# Altium schematic sheet Main.SchDoc: ...
size A4; Author: Eng. Juan Cruz Becerra; CompanyName: www.indiic.com; DrawnBy: Juan Cruz Becerra; Engineer: Juan Cruz Becerra; Organization: INDIIC ®; Address1: Haya de la Torre 183; Address2: X5000; Address3: Córdoba, Argentina; Address4: .; DocumentNumber: 00-00; Revision: XX; SheetNumber: 1; SheetTotal: 1
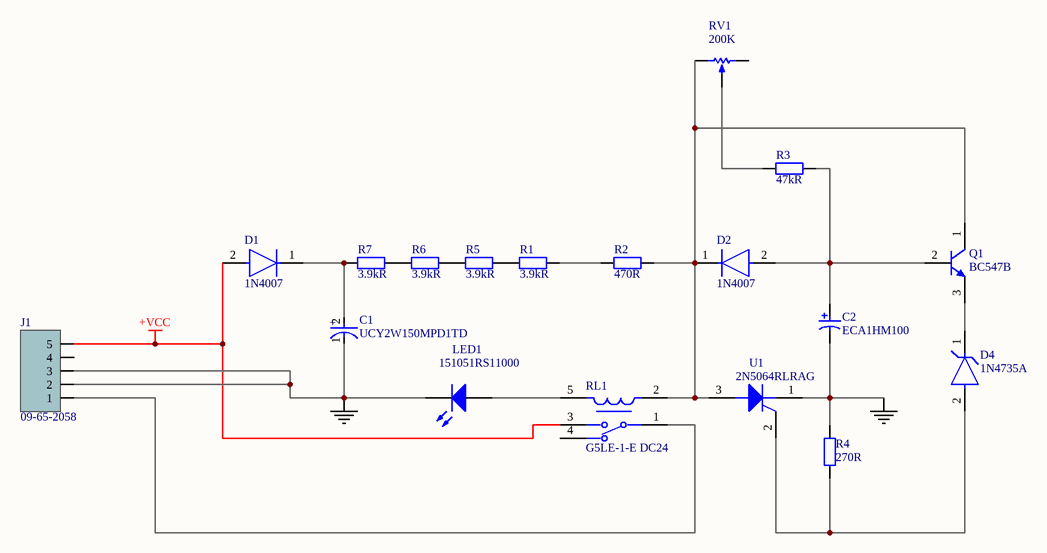
[diagram p0: Main.SchDoc]

## Parts
C1  UCY2W150MPD1TD  [FP-UCY2W150MPD1TD-MFG]
C2  ECA1HM100  [CAPPR55-200-1100X500X1200]
D1  1N4007  [FP-1N4007-MFG]
D2  1N4007  [FP-1N4007-MFG]
D4  1N4735A  [FP-017AH-MFG]
J1  Manufacturer Part Number: 09-65-2058  [09652058]  (hidden comment: 09652058)
LED1  151051RS11000  [Type 5mm]
Q1  BC547B  [ONSC-TO-92-3-29-11]
R1  Resistance: 3.9kR  [AXIAL-0.7]  (hidden comment: PR02000203901JA100)
R2  value 470R  [AXIAL-0.4]  (hidden comment: SFR16S0004700JA500)
R3  value 47kR  [AXIAL-0.4]  (hidden comment: RNF14FTD47K0)
R4  Resistance: 270R  [AXIAL-0.4]  (hidden comment: SFR16S0002700JA500)
R5  Resistance: 3.9kR  [AXIAL-0.7]  (hidden comment: PR02000203901JA100)
R6  Resistance: 3.9kR  [AXIAL-0.7]  (hidden comment: PR02000203901JA100)
R7  Resistance: 3.9kR  [AXIAL-0.7]  (hidden comment: PR02000203901JA100)
RL1  G5LE-1-E DC24  [FP-G5LE-1-E_DC24-MFG]
RV1  200K  [HDR1X2]
U1  2N5064RLRAG  [ONSC-TO-92-3-29-11]

## Nets
+VCC: D1.2(A) J1.5 RL1.3
GND: C1.1(C) C2.2 J1.2 J1.3 LED1.1(K) R4.2 U1.1(K)
NetC1_2: C1.2(A) D1.1(C) R7.2
NetC2_1: C2.1 D2.2(A) Q1.2(B) R3.2
NetD2_1: D2.1(C) Q1.1(C) R2.2 RL1.2 RV1.1(TOP) U1.3(A)
NetD4_1: D4.1(C) Q1.3(E)
NetD4_2: D4.2(A) R4.1 U1.2(G)
NetJ1_1: J1.1 RL1.1
NetLED1_2: LED1.2(A) RL1.5
NetR1_1: R1.1 R5.1
NetR1_2: R1.2 R2.1
NetR3_1: R3.1 RV1.3(TAP)
NetR5_2: R5.2 R6.2
NetR6_1: R6.1 R7.1

Not connected (* = marked no-connect by the designer): J1 4; RL1 4; RV1 2(BOT)

## Notes on the sheet
- Title
- Size:
- Date:
- Drawn By:
- A4
- Number:
- Time:
- Revision:
- Sheet
- Engineer:
- of
- File:
- (in symbol CMP-12462-000049-1) +

## Library data of the parts
C1 = CMP-12462-000049-1: CAP ALUM 15UF 20% 450V RADIAL; Life (Hours): 12000Hour; Ripple Current: 185mA; Capacitance: 15uF; Lead Pitch: 0.197inch; Height - Seated (Max): 1.043inch; Mount: Through Hole; Packaging: Tape and Reel; Voltage Rating: 450V; Min Operating Temperature: -25°C; Max Operating Temperature: 105°C; Tolerance: 20%; Package Quantity: 500; Case/Package: Radial
C2 = CMP-1665-00038-2: Aluminum Electrolytic Capacitor, 10 uF, +/- 20%, 50 V, -40 to 85 degC, 2-Pin THD, RoHS, Bulk; Manufacturer: Panasonic; Life (Hours): 2000Hour; Lead/Base Style: Straight; Dissipation Factor: 0.12%; Capacitance: 10uF; Leakage Current: 3uA; Dielectric Material: Aluminium; Lead Diameter: 0.5mm; Voltage Rating: 50V; Ripple Current: 65mA; Package Reference: CAPPR55-200-1100X500X1200; Height: 11mm; Diameter: 5mm; REACH SVHC: NoSVHC; Mount: ThroughHole; Packaging: Bulk; Manufacturer URL: http://www.panasonic.com/; Termination: Radial; Datasheet URL: https://industrial.panasonic.com/cdbs/www-data/pdf/RDF0000/ABA0000C1218.pdf; Lead Free: LeadFree; Height - Seated (Max): 0.472inch; Case/Package: Radial; Package Description: 2-Pin Radial Lead, Dia 5 mm, Height 12 mm; Tolerance: 20%; Datasheet Version: Rev. 05, 10/2016; Package Quantity: 200; Ripple Current (AC): 65mA; Min Operating Temperature: -40degC; RoHSCompliant: true; Number of Pins: 2; Max Operating Temperature: 85degC; Voltage: 50V; Lead Pitch: 2mm; Radiation Hardening: No; Voltage Rating (DC): 50V; Length: 11mm
D1 D2 = CMP-123542-000001-1: Rectifier diode 1000 V 1 A DO-41, ,; Manufacturer: Diotec; Max Surge Forward Current: 27A; Forward Current: 1A; Max Junction Temp: +175°C; Reverse Voltage: 1000V; Value: 15pF; Peak Reverse Current: 5uA; Category: Diode; Temperature Range Low: -50°C; Automotive: No; Temperature: -50°C to +175°C; Lead Free: Yes; ComponentLink2Description: Datasheet; Max Repetitive Reverse Voltage: 1000V; ComponentLink2URL: https://datasheet.octopart.com/1N4007-Diotec-datasheet-62346875.pdf; Manufacturer Part Number: 1N4007; Device Class L3: Rectifier Diodes; Height: 2.8mm; Octopart: https://octopart.com/1n4007-diotec-4040411; Package: 1N4007; Temperature Range High: +175°C; Device Class L1: Discrete Semiconductors; Device Class L2: Diodes; RoHS: TRUE; Capacitance: 15pF; Ipc Land Pattern Name: DIOAD888W100L520D280
D4 = CMP-0892-00008-2: DIODE ZENER 6.2V 1W DO41; Manufacturer: ON Semiconductor; Max Junction Temp: +200°C; Reverse Voltage: 3V; Max Zener Voltage: 6.51V; Zener Impedance: 2Ω; Max Reverse Leakage Current: 10uA; Device Class L2: Diodes; Ipc Land Pattern Name: DIOPA1088W105L520D272; Temperature Range High: +200°C; Device Class L3: Zener Diodes; Digikey Description: DIODE ZENER 6.2V 1W DO41; Lead Free: Yes; Octopart: https://octopart.com/1n4735a-on+semiconductor-3533934; Power Dissipation: 1W; ComponentLink2Description: Datasheet; RoHS: TRUE; ComponentLink2URL: https://www.onsemi.cn/PowerSolutions/document/1N4736AT-D.PDF; Automotive: No; Package: 017AH; Footprint Url: https://www.onsemi.com/pub/Collateral/017AH.PDF; Manufacturer Part Number: 1N4735A; Height: 2.72mm; Temperature Range Low: -65°C; Mouser Description: Zener Diodes 6.2V 1W ZENER 5%; Device Class L1: Discrete Semiconductors; Nom Zener Voltage: 6.2V; Category: Diode; Temperature: -65°C to +200°C
J1 = 09652058: SPOX™ and KK® 396 Wire-to-Board Header, Vertical, with Friction Lock, 5 Circuits; Manufacturer: Molex; Number of Positions: 5; Current Rating: 7A; Voltage Rating: 250V; Contact Resistance: 10mR; Gender: Male; Pitch: 3.96mm; RoHS: Yes; Category: Headers and Wire Housings; Mount: Through Hole; Contact Plating: Tin,Copper; Housing Material: Nylon; Contact Material: Brass; Housing Color: Natural; Min Operating Temperature: -40°C; Max Operating Temperature: 105°C; Number of Rows: 1; Packaging: Bag; Termination: Solder; Number of Contacts: 5; Orientation: Straight; Series: 5273; Package Quantity: 4000; Max Voltage Rating (AC): 250V; Voltage Rating (DC): 250V; Max Current Rating: 7A; Length: 19.04mm; Height: 13.85mm; Depth: 10.75mm; Radiation Hardening: No; RoHS Compliant: Yes; Lead Free: Lead Free; REACH SVHC: Unknown; ComponentLink1URL: https://datasheet.ciiva.com/5162/0009652058-pcb-headers-131639-5162529.pdf?src-supplier=Mouser; ComponentLink1Description: https://datasheet.ciiva.com/5162/0009652058-pcb-headers-131639-5162529.pdf?src-supplier=Mouser; ComponentLink2URL: https://datasheet.ciiva.com/27055/1961065-27055322.pdf?src-supplier=Jameco; ComponentLink2Description: https://datasheet.ciiva.com/27055/1961065-27055322.pdf?src-supplier=Jameco; ComponentLink3URL: https://datasheet.ciiva.com/30153/50910009652058-pcb-headers-30153267.pdf?src-supplier=Onlinecomponents.com; ComponentLink3Description: https://datasheet.ciiva.com/30153/50910009652058-pcb-headers-30153267.pdf?src-supplier=Onlinecomponents.com; ComponentLink4URL: https://datasheet.ciiva.com/11747/0900766b80d59e72-11747383.pdf?src-supplier=RSComponents; ComponentLink4Description: https://datasheet.ciiva.com/11747/0900766b80d59e72-11747383.pdf?src-supplier=RSComponents; ComponentLink5URL: https://datasheet.ciiva.com/9468/0009652058-pcb-headers-9468429.pdf?src-supplier=Avnet; ComponentLink5Description: https://datasheet.ciiva.com/9468/0009652058-pcb-headers-9468429.pdf?src-supplier=Avnet; ComponentLink6URL: https://datasheet.ciiva.com/49274/523830-49274679.pdf?src-supplier=Jameco; ComponentLink6Description: https://datasheet.ciiva.com/49274/523830-49274679.pdf?src-supplier=Jameco; Pricing 1: 10=0.44700, 200=0.37700, 750=0.32200, 3000=0.27000, 6000=0.22800 (USD); Stock 1: 380; Supplier Part Number 1: 6705243; Supplier 1: RSComponents
LED1 = CMP-1488-00008-1: THT LED round mono-color color lens, WL-TMRW, Red; Manufacturer: Wuerth Elektronik; PackageReference: Type 5mm; PartNumber: 151051RS11000; ComponentLink2URL: http://katalog.we-online.de/pbs/datasheet/7448042001.pdfhttp://katalog.we-online.de/pbs/datasheet/7448042001.pdfhttp://katalog.we-online.de/pbs/datasheet/7448042001.pdfhttp://katalog.we-online.de/pbs/datasheet/151051RS11000.pdf; ComponentLink1URL: http://www.we-online.com; ComponentLink1Description: Manufacturer URL; ComponentLink2Description: Datasheet; Emitting color: Red
Q1 = CMP-1048-01437-1: Amplifier Transistor, NPN Silicon, 3-Pin TO-92, Bulk Box; Manufacturer: On Semiconductor; PartNumber: BC547C; IC Continuous (A): 0.1; fT Min (MHz): 150; Mounting Technology: Through Hole; ComponentLink1URL: http://www.onsemi.com/; ComponentLink1Description: Manufacturer URL; ComponentLink3URL: http://www.onsemi.cn/pub_link/Collateral/2N6426-D.PDF; DatasheetVersion: Rev. 7; PackageVersion: Rev. AM; Packing: Bulk Box; RoHS: FALSE; Polarity: NPN; ComponentLink2URL: http://www.onsemi.com/pub_link/Collateral/BC546-D.PDF; ComponentLink3Description: Package Specification; PackageDescription: 3-Pin Transistor Outline, Body 4.825 x 3.685 mm, Pitch 1.27 mm; PackageReference: TO-92-3-29-11_AM_SL; ComponentLink2Description: Datasheet
R1 R5-R7 = Res2: PR02 Series Axial Metal Film Resistor 3.9kOhms +/-5% 2W +/-250ppm/degC; Manufacturer: Vishay; Value: 1K; Tolerance: 5%; Temperature Coefficient: 250ppm/°C; Operating Supply Voltage: 500V; Published: 8-Jun-2000; LatestRevisionDate: 17-Jul-2002; LatestRevisionNote: Re-released for DXP Platform.; PackageReference: AXIAL-0.4; Publisher: Altium Limited; PackageDescription: Axial Device, Thru-Hole; 2 Leads; 0.4 in Pin Spacing; Supplier 1: Digi-Key; Supplier Part Number 1: BC4797CT-ND; Manufacturer Part Number: PR02000203901JA100; RoHS: Yes; Category: Through-Hole Resistors; Stock 1: 9592; Pricing 1: 1=0.40000, 10=0.31000, 25=0.23640, 50=0.17560, 100=0.13050, 250=0.11024, 500=0.09450 (USD); Mount: Through Hole; Case/Package: Conformal; Contact Plating: Tin; Min Operating Temperature: -55°C; Max Operating Temperature: 155°C; Power Rating: 2W; Resistor Type: Metal Film; Packaging: Ammo Pack; Series: PR02; Termination: Axial; Construction: Cylindrical; Technology: METAL FILM; Diameter: 3.9mm; Length: 12mm; Width: 3.9mm; Radiation Hardening: No; RoHS Compliant: Yes; Military Standard: Not; Lead Free: Lead Free; ComponentLink1URL: https://datasheet.ciiva.com/15158/getdatasheetpartid-101804-15158417.pdf?src-supplier=Verical; ComponentLink1Description: https://datasheet.ciiva.com/15158/getdatasheetpartid-101804-15158417.pdf?src-supplier=Verical; ComponentLink2URL: https://datasheet.ciiva.com/11826/0900766b80d9a182-11826978.pdf?src-supplier=RSComponents; ComponentLink2Description: https://datasheet.ciiva.com/11826/0900766b80d9a182-11826978.pdf?src-supplier=RSComponents; ComponentLink3URL: https://datasheet.ciiva.com/48426/pr01-02-03-eng-tds-48426105.pdf?src-supplier=Distrelec; ComponentLink3Description: https://datasheet.ciiva.com/48426/pr01-02-03-eng-tds-48426105.pdf?src-supplier=Distrelec
R2 = Res2: 470 Ohms ±5% 0.5W, 1/2W Through Hole Resistor Axial - Metal Film; Manufacturer: Vishay BCcomponents; Temperature Coefficient: 100ppm/°C; Power Rating: 500mW; Voltage Rating: 200V; Lead Diameter: 0.45mm; Lead Length: 26mm; Published: 8-Jun-2000; LatestRevisionDate: 17-Jul-2002; LatestRevisionNote: Re-released for DXP Platform.; PackageReference: AXIAL-0.4; Publisher: Altium Limited; PackageDescription: Axial Device, Thru-Hole; 2 Leads; 0.4 in Pin Spacing; Supplier 1: Digi-Key; Supplier Part Number 1: BC4327CT-ND; Manufacturer Part Number: SFR16S0004700JA500; RoHS: Yes; Category: Through-Hole Resistors; Stock 1: 23287; Pricing 1: 1=0.15000, 10=0.12400, 25=0.09040, 50=0.06560, 100=0.04860, 250=0.03728, 500=0.02938, 1000=0.02034 (USD); Case/Package: Conformal; Contact Plating: Tin; Min Operating Temperature: -55°C; Max Operating Temperature: 155°C; Resistance: 470R; Tolerance: 5%; Resistor Type: Metal Film; Packaging: Tape and Reel; Number of Terminations: 2; Termination: Axial; Max Power Dissipation: 500mW; Series: SFR16S; Construction: Cylindrical; Resistance Tolerance: 5%; Diameter: 1.9mm; Length: 4.1mm; Radiation Hardening: No; REACH SVHC: Unknown; Military Standard: Not; RoHS Compliant: Yes; ComponentLink1URL: https://datasheet.ciiva.com/8397/sfr16s25-8397288.pdf?src-supplier=Avnet; ComponentLink1Description: https://datasheet.ciiva.com/8397/sfr16s25-8397288.pdf?src-supplier=Avnet; ComponentLink2URL: https://datasheet.ciiva.com/7851/572067-7851837.pdf?src-supplier=Element14; ComponentLink2Description: https://datasheet.ciiva.com/7851/572067-7851837.pdf?src-supplier=Element14
R3 = Res2: Res Metal Film 47K Ohm 1% 1/4W ±100ppm/°C Conformal AXL Thru-Hole T/R; Manufacturer: Stackpole Electronics; Power Rating: 250mW; Published: 8-Jun-2000; LatestRevisionDate: 17-Jul-2002; LatestRevisionNote: Re-released for DXP Platform.; PackageReference: AXIAL-0.4; Publisher: Altium Limited; PackageDescription: Axial Device, Thru-Hole; 2 Leads; 0.4 in Pin Spacing; Supplier 1: Digi-Key; Supplier Part Number 1: RNF14FTD47K0CT-ND; Manufacturer Part Number: RNF14FTD47K0; RoHS: Yes; Category: Through-Hole Resistors; Stock 1: 20607; Pricing 1: 1=0.10000, 10=0.06500, 25=0.04480, 50=0.03500, 100=0.02500, 250=0.01952, 500=0.01550, 1000=0.01100 (USD); Mount: Through Hole,Axial; Case/Package: Conformal; Contact Plating: Copper,Tin; Min Operating Temperature: -55°C; Max Operating Temperature: 155°C; Tolerance: 1%; Resistance: 47kR; Packaging: Tape and Reel; Package Quantity: 1; Resistor Type: Metal Film; Number of Terminations: 2; Termination: Axial; Max Power Dissipation: 250mW; Temperature Coefficient: 100ppm/°C; Features: Flame Retardant Coating; Series: RN; Construction: Cylindrical; Diameter: 2.35mm; Length: 6.35mm; Radiation Hardening: No; Lead Free: Lead Free; RoHS Compliant: Yes; ComponentLink1URL: http://components.arrow.com/part/dataview/46839537S9856773N1174?src-supplier=Arrow+Electronics; ComponentLink1Description: http://components.arrow.com/part/dataview/46839537S9856773N1174?src-supplier=Arrow+Electronics; ComponentLink2URL: https://www.seielect.com/Catalog/SEI-RNF_RNMF.pdf?src-supplier=Digi-Key; ComponentLink2Description: https://www.seielect.com/Catalog/SEI-RNF_RNMF.pdf?src-supplier=Digi-Key; ComponentLink3URL: https://www.seielect.com/Catalog/SEI-RNF_RNMF.pdf?src-supplier=Avnet; ComponentLink3Description: https://www.seielect.com/Catalog/SEI-RNF_RNMF.pdf?src-supplier=Avnet; ComponentLink4URL: http://www.seielect.com/Catalog/SEI-RNF_RNMF.pdf?src-supplier=Future+Electronics; ComponentLink4Description: http://www.seielect.com/Catalog/SEI-RNF_RNMF.pdf?src-supplier=Future+Electronics
R4 = Res2: VISHAY         SFR16S0002700JA500             Through Hole Resistor, 270 ohm, 200 V, Axial Leaded, 500 mW,  5%, SFR16S Series; Manufacturer: Vishay BCcomponents; Value: 270; Temperature Coefficient: 100ppm/°C; Power Rating: 500mW; Voltage Rating: 200V; Lead Diameter: 0.45mm; Lead Length: 26mm; Published: 8-Jun-2000; LatestRevisionDate: 17-Jul-2002; LatestRevisionNote: Re-released for DXP Platform.; PackageReference: AXIAL-0.4; Publisher: Altium Limited; PackageDescription: Axial Device, Thru-Hole; 2 Leads; 0.4 in Pin Spacing; Supplier 1: Digi-Key; Supplier Part Number 1: BC4316CT-ND; Manufacturer Part Number: SFR16S0002700JA500; RoHS: Yes; Category: Through-Hole Resistors; Stock 1: 4317; Pricing 1: 1=0.15000, 10=0.12400, 25=0.09040, 50=0.06560, 100=0.04860, 250=0.03728, 500=0.02938, 1000=0.02034 (USD); Case/Package: Conformal; Contact Plating: Tin; Min Operating Temperature: -55°C; Max Operating Temperature: 155°C; Tolerance: 5%; Resistor Type: Metal Film; Termination: Axial; Packaging: Ammo Pack; Number of Terminations: 2; Max Power Dissipation: 500mW; Series: SFR16S; Resistance Tolerance: 5%; Construction: Cylindrical; Diameter: 1.9mm; Length: 4.1mm; Radiation Hardening: No; REACH SVHC: Unknown; Military Standard: Not; RoHS Compliant: Yes; ComponentLink1URL: https://datasheet.ciiva.com/7851/572067-7851822.pdf?src-supplier=Element14; ComponentLink1Description: https://datasheet.ciiva.com/7851/572067-7851822.pdf?src-supplier=Element14
RL1 = CMP-08822-000256-1: RELAY GEN PURPOSE SPDT 16A 24V; Release Time: 5ms; Application(s): POWER; Coil Resistance: 1.44kR; Power Consumption: 400mW; Max Voltage Rating (AC): 250V; Coil Current: 16.7mA; Life (Hours): 1000000Hour; Operate Time: 10ms; Coil Type: Non-Latching; Relay Type: General Purpose; Max Operating Temperature: 85°C; Radiation Hardening: No; Package Quantity: 500; Packaging: Tray; Lead Free: Lead Free; Depth: 16.5mm; Throw Configuration: SPDT; Contact Current Rating: 16A; Mount: Through Hole; Termination: PC Pin; Min Operating Temperature: -40°C; Height: 19mm; Coil Power: 400mW; Contact Material: Tin; Series: G5LE-E; Length: 22.5mm; Width: 16.5mm; Coil Voltage (DC): 24V; Max Current Rating: 16A; Number of Pins: 5
RV1 = RPot: P160 Series 200 kOhm ±20 % Panel Mount Multi-Turn Potentiometer; Manufacturer: TT BI; Manufacturer Part Number: P160KNP-0QC15B200K; Sim Note: Enter the Resistance value and the set point into parameter fields.; Set Position: 0.5; Tolerance: 20%; Resistance: 200kR; Power Rating: 200mW; Number of Gangs: 1; Actuator Length: 0.591inch; Actuator Diameter: 0.236inch; Published: 8-Jun-2000; LatestRevisionDate: 17-Jul-2002; LatestRevisionNote: Re-released for DXP Platform.; PackageReference: VR5; Publisher: Altium Limited; PackageDescription: Variable Resistor, Thru-Hole; 3 Leads; Value: 200K; Supplier 1: Digi-Key; Supplier Part Number 1: 987-1732-ND; RoHS: Yes; Category: Uncategorized; Stock 1: 1002; Pricing 1: 1=0.85000, 10=0.75000, 25=0.67520, 40=0.65000, 80=0.62500, 230=0.58748, 440=0.50000, 1100=0.46250, 5500=0.38000 (USD); Mount: Panel; Packaging: Tray; Package Quantity: 300; Resistor Type: Conductive Plastic; Taper: Linear; Number of Turns: 1; Termination: Solder; Max Power Dissipation: 200mW; Series: P160; Lead Free: Lead Free; RoHS Compliant: Yes; ComponentLink1URL: https://datasheet.ciiva.com/4992/p160-20748-4992393.pdf?src-supplier=Mouser; ComponentLink1Description: https://datasheet.ciiva.com/4992/p160-20748-4992393.pdf?src-supplier=Mouser
U1 = CMP-1068-00148-1: Sensitive Gate Silicon Controlled Rectifier, Reverse Blocking Thyristor, 3-Pin TO-92, Pb-Free, Tape and Reel; Manufacturer: On Semiconductor; ITSM Max (A): 10; IT(RMS) Max (A): 0.8; PackageReference: TO-92-3-29-11_AM_SL; ComponentLink1URL: http://www.onsemi.com/; RoHS: Pb-Free; ComponentLink3URL: http://www.onsemi.cn/pub_link/Collateral/2N6426-D.PDF; ComponentLink1Description: Manufacturer URL; PartNumber: 2N5064RLRAG; Packing: Tape and Reel; ComponentLink3Description: Package Specification; DatasheetVersion: Rev. 10; PackageDescription: 3-Pin Transistor Outline, Body 4.825 x 3.685 mm, Pitch 1.27 mm; ComponentLink2Description: Datasheet; PackageVersion: Rev. AM; Mounting Technology: Through Hole; ComponentLink2URL: http://www.onsemi.cn/pub_link/Collateral/2N5060-D.PDF